# Altium schematic sheet 5V.SchDoc
size A4
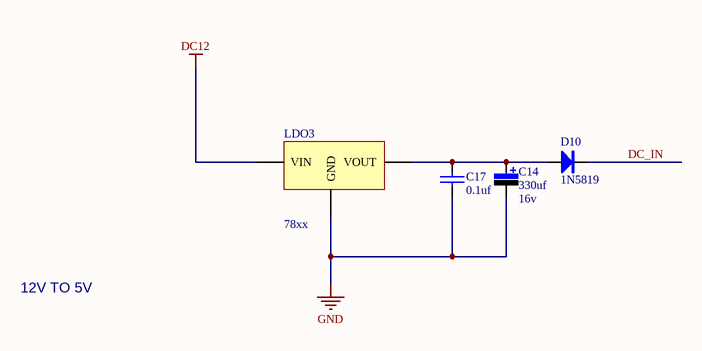
[diagram p0: 5V.SchDoc]

## Parts
C14  value 330uf  value 16v  [CAP 16v330uf（6*8）]  (hidden comment: 05.Cap-EC)
C17  value 0.1uf  [C 0603]  (hidden comment: 04.Cap)
D10  1N5819  [D 1N5819W-SOD123]
LDO3  78xx  [78M05]

## Nets
DC12: LDO3.VIN
GND: C14.2 C17.2 LDO3.GND
DC_IN: D10.K
NetC14_1: C14.1 C17.1 D10.A LDO3.VOUT

## Notes on the sheet
- 12V TO 5V

## Library data of the parts
C14 = 05.Cap-EC: 电解电容
C17 = 04.Cap: 电容
D10 = 12.Diode: 二极管
LDO3 = 78xx: 线性稳压芯片; 版权归属: 源创客; BOM名称: 线性稳压芯片; 学习资源: www.ooocke.com